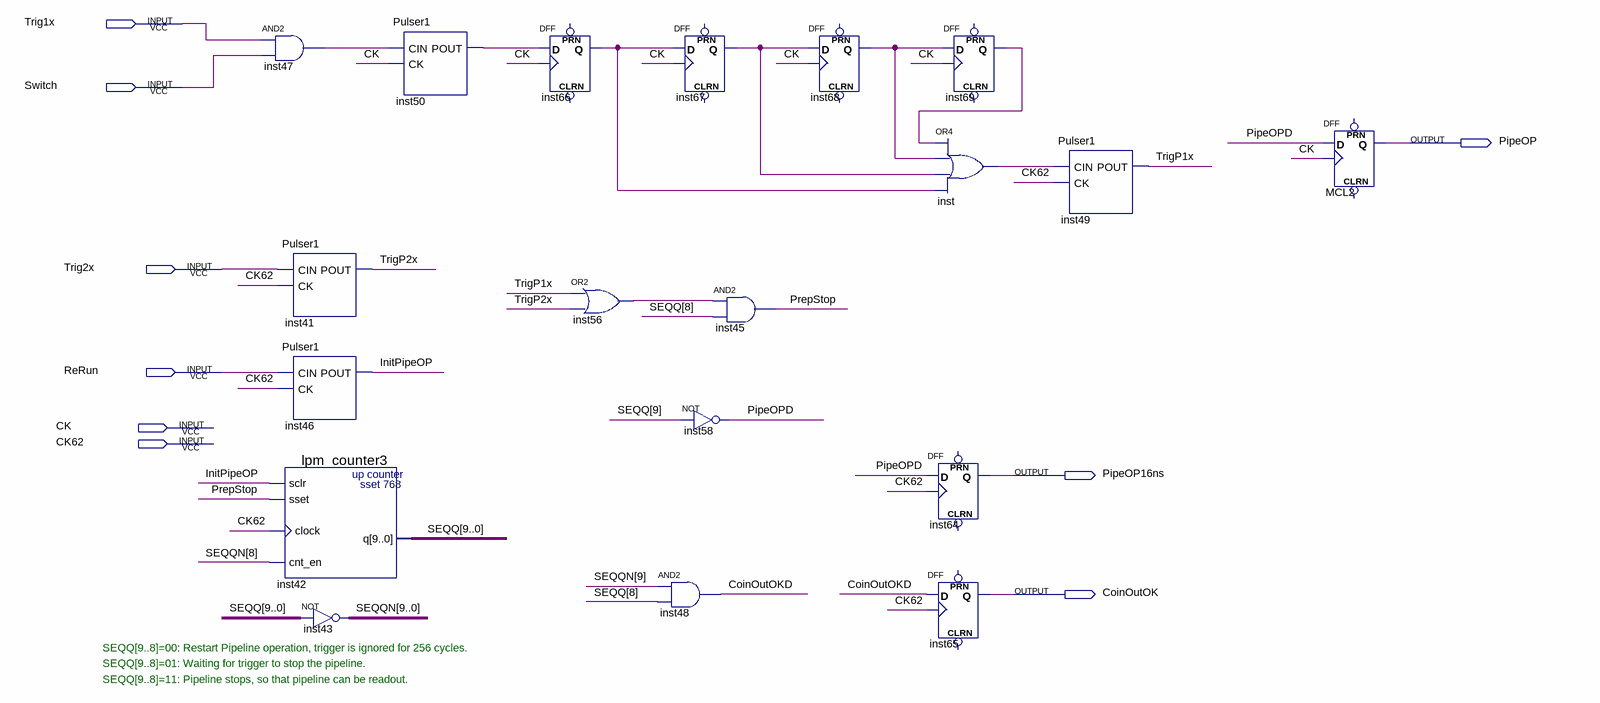
[diagram p0: schematic sheet]
// Quartus schematic TrigSeq3.bdf as structural Verilog: 19 symbols, 9 pins
module TrigSeq3 (
  input  Trig1x,
  input  Switch,
  input  Trig2x,
  input  ReRun,
  input  CK,
  input  CK62,
  output PipeOP,
  output PipeOP16ns,
  output CoinOutOK
);

  wire CoinOutOKD, InitPipeOP, inst47_out, inst50_pout, inst56_out, inst66_q, inst67_q, inst68_q, inst69_q,
       inst_out, PipeOPD, PrepStop, TrigP1x, TrigP2x;
  wire [9:0] SEQQ, SEQQN;

  and inst47 (inst47_out, Trig1x, Switch);
  Pulser1 inst41 (.CIN(Trig2x), .CK(CK62), .POUT(TrigP2x));
  Pulser1 inst46 (.CIN(ReRun), .CK(CK62), .POUT(InitPipeOP));
  lpm_counter3 inst42 (.sclr(InitPipeOP), .sset(PrepStop), .clock(CK62), .cnt_en(SEQQN[8]), .q(SEQQ));
  assign SEQQN = ~SEQQ;  // NOT inst43, 10 bits wide
  Pulser1 inst50 (.CIN(inst47_out), .CK(CK), .POUT(inst50_pout));
  DFF inst66 (.CLK(CK), .D(inst50_pout), .Q(inst66_q));  // open: CLRN, PRN
  or inst56 (inst56_out, TrigP1x, TrigP2x);
  DFF inst67 (.CLK(CK), .D(inst66_q), .Q(inst67_q));  // open: CLRN, PRN
  not inst58 (PipeOPD, SEQQ[9]);
  and inst48 (CoinOutOKD, SEQQN[9], SEQQ[8]);
  and inst45 (PrepStop, inst56_out, SEQQ[8]);
  DFF inst68 (.CLK(CK), .D(inst67_q), .Q(inst68_q));  // open: CLRN, PRN
  DFF inst69 (.CLK(CK), .D(inst68_q), .Q(inst69_q));  // open: CLRN, PRN
  or inst (inst_out, inst69_q, inst68_q, inst67_q, inst66_q);
  DFF inst64 (.CLK(CK62), .D(PipeOPD), .Q(PipeOP16ns));  // open: CLRN, PRN
  DFF inst65 (.CLK(CK62), .D(CoinOutOKD), .Q(CoinOutOK));  // open: CLRN, PRN
  Pulser1 inst49 (.CIN(inst_out), .CK(CK62), .POUT(TrigP1x));
  DFF MCL2 (.CLK(CK), .D(PipeOPD), .Q(PipeOP));  // open: CLRN, PRN

  // Notes on the sheet:
  //   SEQQ[9..8]=00: Restart Pipeline operation, trigger is ignored for 256 cycles.
  //   SEQQ[9..8]=01: Waiting for trigger to stop the pipeline.
  //   SEQQ[9..8]=11: Pipeline stops, so that pipeline can be readout.
endmodule
